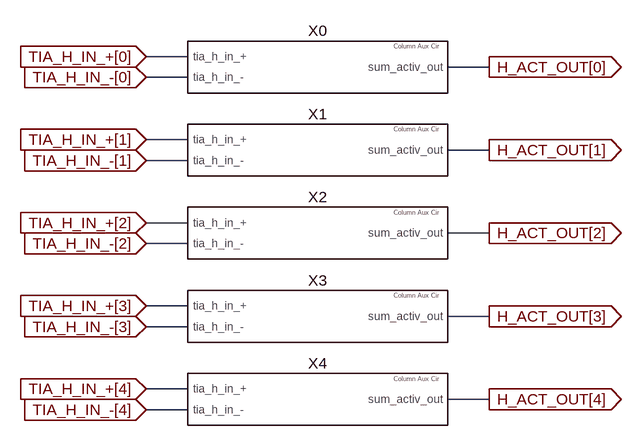
[diagram p0: schematic X_aux_10by5.asc]
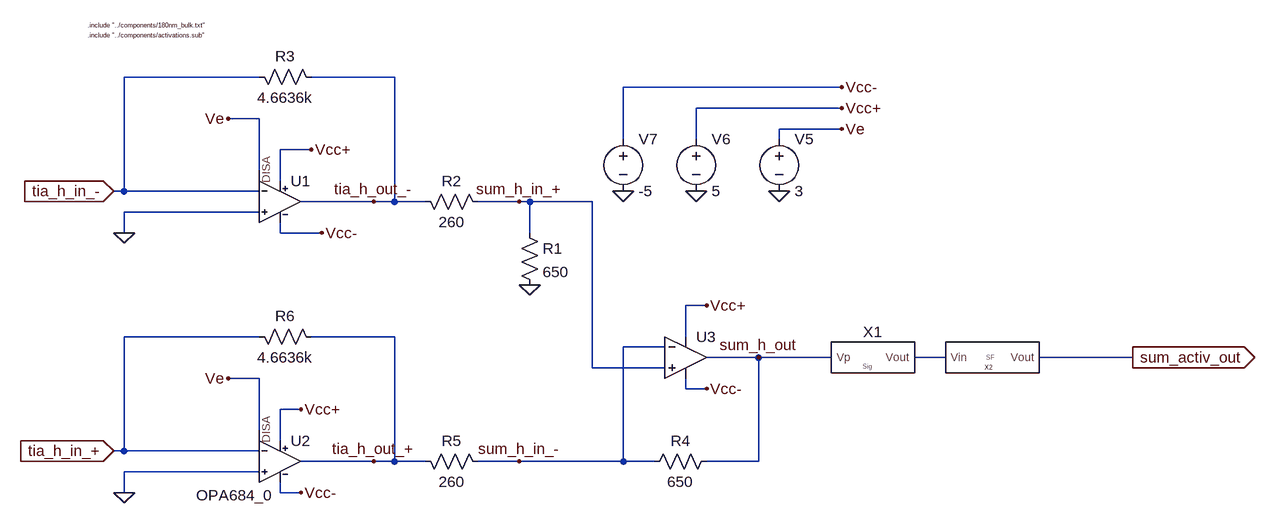
[diagram p1: sub-circuit column_activ_cmos.asc]
X_aux_10by5.asc, the LTspice schematic file:
Version 4 
SHEET 1 880 680
WIRE 48 80 -16 80
WIRE 48 112 -16 112
WIRE 512 96 448 96
WIRE 48 208 -16 208
WIRE 48 240 -16 240
WIRE 512 224 448 224
WIRE 48 336 -16 336
WIRE 48 368 -16 368
WIRE 512 352 448 352
WIRE 48 464 -16 464
WIRE 48 496 -16 496
WIRE 512 480 448 480
WIRE 48 592 -16 592
WIRE 48 624 -16 624
WIRE 512 608 448 608
FLAG -16 80 TIA_H_IN_+[0]
IOPIN -16 80 IN
FLAG -16 112 TIA_H_IN_-[0]
IOPIN -16 112 IN
FLAG 512 96 H_ACT_OUT[0]
IOPIN 512 96 OUT
FLAG -16 208 TIA_H_IN_+[1]
IOPIN -16 208 IN
FLAG -16 240 TIA_H_IN_-[1]
IOPIN -16 240 IN
FLAG 512 224 H_ACT_OUT[1]
IOPIN 512 224 OUT
FLAG -16 336 TIA_H_IN_+[2]
IOPIN -16 336 IN
FLAG -16 368 TIA_H_IN_-[2]
IOPIN -16 368 IN
FLAG 512 352 H_ACT_OUT[2]
IOPIN 512 352 OUT
FLAG -16 464 TIA_H_IN_+[3]
IOPIN -16 464 IN
FLAG -16 496 TIA_H_IN_-[3]
IOPIN -16 496 IN
FLAG 512 480 H_ACT_OUT[3]
IOPIN 512 480 OUT
FLAG -16 592 TIA_H_IN_+[4]
IOPIN -16 592 IN
FLAG -16 624 TIA_H_IN_-[4]
IOPIN -16 624 IN
FLAG 512 608 H_ACT_OUT[4]
IOPIN 512 608 OUT
SYMBOL column_activ_cmos 240 96 R0
SYMATTR InstName X0
SYMBOL column_activ_cmos 240 224 R0
SYMATTR InstName X1
SYMBOL column_activ_cmos 240 352 R0
SYMATTR InstName X2
SYMBOL column_activ_cmos 240 480 R0
SYMATTR InstName X3
SYMBOL column_activ_cmos 240 608 R0
SYMATTR InstName X4

column_activ_cmos.asc, the sub-circuit schematic file:
Version 4
SHEET 1 2360 680
WIRE 160 -128 -48 -128
WIRE 368 -128 240 -128
WIRE 1056 -112 720 -112
WIRE 1056 -80 832 -80
WIRE 160 -64 112 -64
WIRE 1056 -48 960 -48
WIRE 720 -32 720 -112
WIRE 832 -32 832 -80
WIRE 960 -32 960 -48
WIRE 240 -16 192 -16
WIRE 160 16 160 -64
WIRE 192 32 192 -16
WIRE -48 48 -48 -128
WIRE -48 48 -64 48
WIRE 160 48 -48 48
WIRE 336 64 224 64
WIRE 368 64 368 -128
WIRE 368 64 336 64
WIRE 416 64 368 64
WIRE 560 64 496 64
WIRE 576 64 560 64
WIRE 672 64 576 64
WIRE 160 80 -48 80
WIRE -48 112 -48 80
WIRE 192 112 192 96
WIRE 256 112 192 112
WIRE 576 112 576 64
WIRE 848 224 816 224
WIRE 160 272 -48 272
WIRE 368 272 240 272
WIRE 816 272 816 224
WIRE 784 288 720 288
WIRE 928 304 848 304
WIRE 1040 304 928 304
WIRE 1216 304 1168 304
WIRE 1504 304 1360 304
WIRE 672 320 672 64
WIRE 784 320 672 320
WIRE 160 336 112 336
WIRE 816 352 816 336
WIRE 848 352 816 352
WIRE 224 384 192 384
WIRE 160 416 160 336
WIRE 192 432 192 384
WIRE -48 448 -48 272
WIRE -48 448 -64 448
WIRE 160 448 -48 448
WIRE 336 464 224 464
WIRE 368 464 368 272
WIRE 368 464 336 464
WIRE 416 464 368 464
WIRE 560 464 496 464
WIRE 720 464 720 288
WIRE 720 464 560 464
WIRE 768 464 720 464
WIRE 928 464 928 304
WIRE 928 464 848 464
WIRE 160 480 -48 480
WIRE -48 512 -48 480
WIRE 192 512 192 496
WIRE 224 512 192 512
FLAG -48 112 0
FLAG 576 192 0
FLAG 560 64 sum_h_in_+
FLAG 336 64 tia_h_out_-
FLAG 960 48 0
FLAG 832 48 0
FLAG 720 48 0
FLAG 1056 -112 Vcc-
FLAG 1056 -80 Vcc+
FLAG 1056 -48 Ve
FLAG 240 -16 Vcc+
FLAG 256 112 Vcc-
FLAG 112 -64 Ve
FLAG -48 512 0
FLAG 560 464 sum_h_in_-
FLAG 336 464 tia_h_out_+
FLAG 224 384 Vcc+
FLAG 224 512 Vcc-
FLAG 112 336 Ve
FLAG 848 352 Vcc-
FLAG 848 224 Vcc+
FLAG 928 304 sum_h_out
FLAG -64 448 tia_h_in_+
IOPIN -64 448 In
FLAG -64 48 tia_h_in_-
IOPIN -64 48 In
FLAG 1504 304 sum_activ_out
IOPIN 1504 304 Out
SYMBOL res 560 96 R0
SYMATTR InstName R1
SYMATTR Value 650
SYMBOL res 512 80 M270
WINDOW 0 32 56 VTop 2
WINDOW 3 0 56 VBottom 2
SYMATTR InstName R2
SYMATTR Value 260
SYMBOL res 256 -112 M270
WINDOW 0 32 56 VTop 2
WINDOW 3 0 56 VBottom 2
SYMATTR InstName R3
SYMATTR Value 4.6636k
SYMBOL MySym\\opamp2_custom 192 0 R0
WINDOW 3 16 96 Invisible 2
SYMATTR Value ""
SYMATTR InstName U1
SYMATTR SpiceModel OPA684_0
SYMBOL voltage 960 -48 R0
WINDOW 123 0 0 Left 0
WINDOW 39 0 0 Left 0
SYMATTR InstName V5
SYMATTR Value 3
SYMBOL voltage 832 -48 R0
WINDOW 123 0 0 Left 0
WINDOW 39 0 0 Left 0
SYMATTR InstName V6
SYMATTR Value 5
SYMBOL voltage 720 -48 R0
WINDOW 123 0 0 Left 0
WINDOW 39 0 0 Left 0
SYMATTR InstName V7
SYMATTR Value -5
SYMBOL res 864 448 R90
WINDOW 0 0 56 VBottom 2
WINDOW 3 32 56 VTop 2
SYMATTR InstName R4
SYMATTR Value 650
SYMBOL res 512 480 M270
WINDOW 0 32 56 VTop 2
WINDOW 3 0 56 VBottom 2
SYMATTR InstName R5
SYMATTR Value 260
SYMBOL res 256 288 M270
WINDOW 0 32 56 VTop 2
WINDOW 3 0 56 VBottom 2
SYMATTR InstName R6
SYMATTR Value 4.6636k
SYMBOL MySym\\opamp2_custom 192 400 R0
WINDOW 3 16 96 Invisible 2
WINDOW 38 -129 116 Left 2
SYMATTR Value ""
SYMATTR SpiceModel OPA684_0
SYMATTR InstName U2
SYMBOL OpAmps\\opamp2 816 240 R0
WINDOW 3 16 96 Invisible 2
SYMATTR Value ""
SYMATTR InstName U3
SYMATTR SpiceModel MAX4223
SYMBOL MySym\\RNN_Sigmoid3_HA 1104 304 R0
SYMATTR InstName X1
SYMBOL MySym\\sourceFollower 1280 304 R0
SYMATTR InstName X2
TEXT -104 -192 Left 0 !.include "../components/activations.sub"
TEXT -104 -208 Left 0 !.include "../components/180nm_bulk.txt"

The netlist it stands for:
* X_aux_10by5.asc
XX0 TIA_H_IN_+[0] TIA_H_IN_-[0] H_ACT_OUT[0] column_activ_cmos
XX1 TIA_H_IN_+[1] TIA_H_IN_-[1] H_ACT_OUT[1] column_activ_cmos
XX2 TIA_H_IN_+[2] TIA_H_IN_-[2] H_ACT_OUT[2] column_activ_cmos
XX3 TIA_H_IN_+[3] TIA_H_IN_-[3] H_ACT_OUT[3] column_activ_cmos
XX4 TIA_H_IN_+[4] TIA_H_IN_-[4] H_ACT_OUT[4] column_activ_cmos

* block symbol definitions
.subckt column_activ_cmos tia_h_in_+ tia_h_in_- sum_activ_out
R1 sum_h_in_+ 0 650
R2 sum_h_in_+ tia_h_out_- 260
R3 tia_h_out_- tia_h_in_- 4.6636k
XU1 0 tia_h_in_- Vcc+ Vcc- tia_h_out_- Ve OPA684_0  ; pins In+ In- V+ V- OUT DISA
V5 Ve 0 3
V6 Vcc+ 0 5
V7 Vcc- 0 -5
R4 sum_h_out sum_h_in_- 650
R5 sum_h_in_- tia_h_out_+ 260
R6 tia_h_out_+ tia_h_in_+ 4.6636k
XU2 0 tia_h_in_+ Vcc+ Vcc- tia_h_out_+ Ve OPA684_0  ; pins In+ In- V+ V- OUT DISA
XU3 sum_h_in_+ sum_h_in_- Vcc+ Vcc- sum_h_out MAX4223  ; pins In+ In- V+ V- OUT
XX1 sum_h_out N001 RNN_Sigmoid3_HA  ; pins Vp Vout
XX2 N001 sum_activ_out sourceFollower  ; pins Vin Vout
.include "../components/activations.sub"
.include "../components/180nm_bulk.txt"
.ends column_activ_cmos

.backanno
.end